# EAGLE design operator-interface-keypad-r1.1 (EAGLE 5.12)
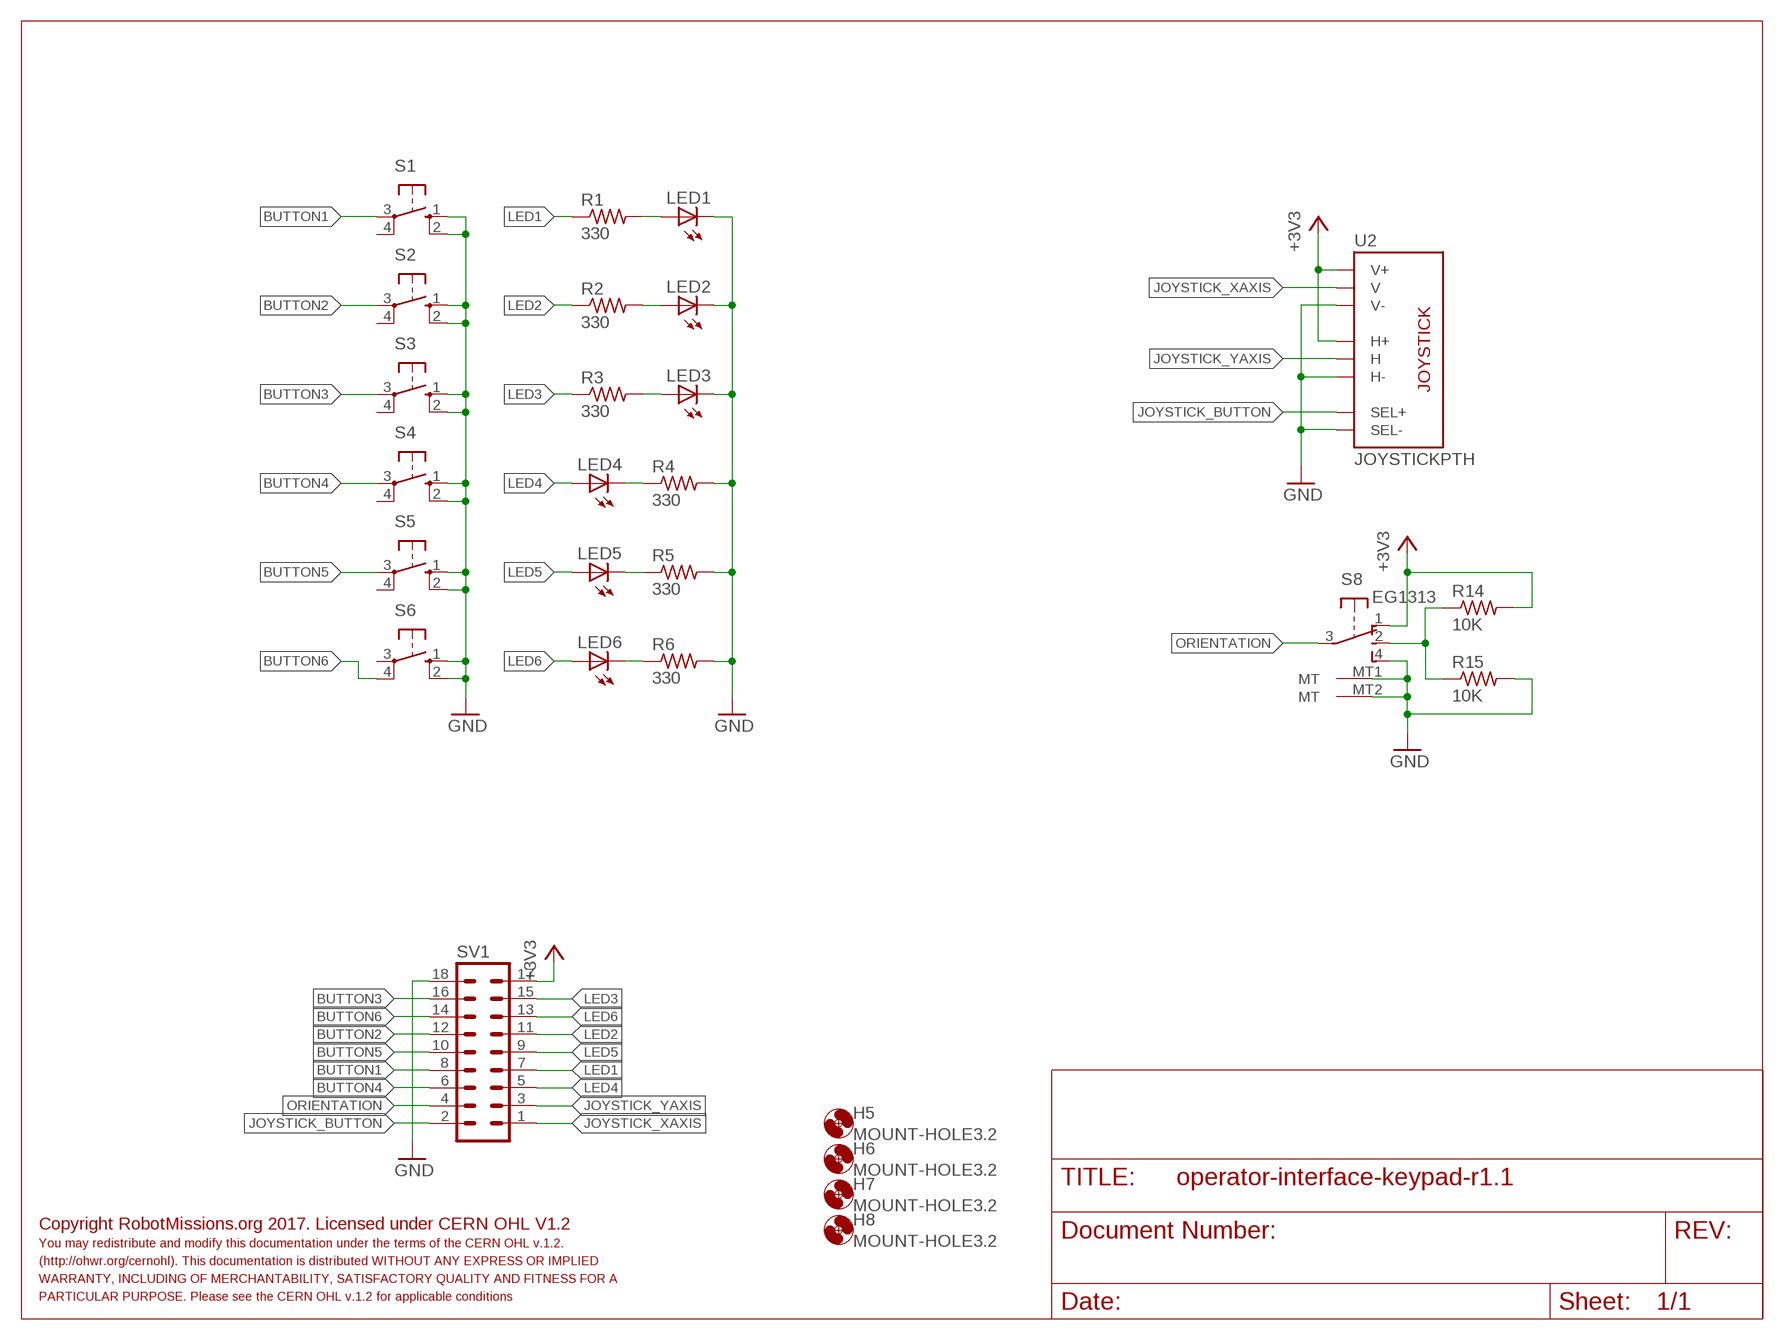
[diagram p0: schematic, sheet 1]

## Parts
H5  MOUNT-HOLE3.2  [3,2]
H6  MOUNT-HOLE3.2  [3,2]
H7  MOUNT-HOLE3.2  [3,2]
H8  MOUNT-HOLE3.2  [3,2]
LED1  LED5MM  [LED5MM]
LED2  LED5MM  [LED5MM]
LED3  LED5MM  [LED5MM]
LED4  LED5MM  [LED5MM]
LED5  LED5MM  [LED5MM]
LED6  LED5MM  [LED5MM]
R1  330  R-US_0207/10  [0207/10]
R2  330  R-US_0207/10  [0207/10]
R3  330  R-US_0207/10  [0207/10]
R4  330  R-US_0207/10  [0207/10]
R5  330  R-US_0207/10  [0207/10]
R6  330  R-US_0207/10  [0207/10]
R14  10K  R-US_0207/10  [0207/10]
R15  10K  R-US_0207/10  [0207/10]
S1  40-XX  [B3F-40XX]
S2  40-XX  [B3F-40XX]
S3  40-XX  [B3F-40XX]
S4  40-XX  [B3F-40XX]
S5  40-XX  [B3F-40XX]
S6  40-XX  [B3F-40XX]
S8  EG1313  [EG1313]
SV1  MA09-2W  [MA09-2W]
U2  JOYSTICKPTH  [JOYSTICK]

## Nets
+3V3: R14.2 S8.1(S1) SV1.17 U2.H1(H+) U2.V1(V+)
BUTTON1: S1.3(P) SV1.8
BUTTON2: S2.3(P) SV1.12
BUTTON3: S3.3(P) SV1.16
BUTTON4: S4.3(P) SV1.6
BUTTON5: S5.3(P) SV1.10
BUTTON6: S6.4(P1) SV1.14
GND: LED1.K(C) LED2.K(C) LED3.K(C) R4.2 R5.2 R6.2 R15.2 S1.1(S) S1.2(S1) S2.1(S) S2.2(S1) S3.1(S) S3.2(S1) S4.1(S) S4.2(S1) S5.1(S) S5.2(S1) S6.1(S) S6.2(S1) S8.4(S3) S8.MT1(MT) S8.MT2(MT) SV1.18 U2.B2A(SEL-) U2.H3(H-) U2.V3(V-)
JOYSTICK_BUTTON: SV1.2 U2.B1A(SEL+)
JOYSTICK_XAXIS: SV1.1 U2.V2(V)
JOYSTICK_YAXIS: SV1.3 U2.H2(H)
LED1: R1.1 SV1.7
LED2: R2.1 SV1.11
LED3: R3.1 SV1.15
LED4: LED4.A SV1.5
LED5: LED5.A SV1.9
LED6: LED6.A SV1.13
N$3: R14.1 R15.1 S8.2(S2)
N$4: LED1.A R1.2
N$5: LED2.A R2.2
N$6: LED3.A R3.2
N$7: LED4.K(C) R4.1
N$8: LED5.K(C) R5.1
N$9: LED6.K(C) R6.1
ORIENTATION: S8.3(COM) SV1.4
Unconnected: S1.4(P1) S2.4(P1) S3.4(P1) S4.4(P1) S5.4(P1) S6.3(P)

## Notes on the sheet
- Copyright RobotMissions.org 2017. Licensed under CERN OHL V1.2
- You may redistribute and modify this documentation under the terms of the CERN OHL v.1.2.
- (http://ohwr.org/cernohl). This documentation is distributed WITHOUT ANY EXPRESS OR IMPLIED
- WARRANTY, INCLUDING OF MERCHANTABILITY, SATISFACTORY QUALITY AND FITNESS FOR A
- PARTICULAR PURPOSE. Please see the CERN OHL v.1.2 for applicable conditions

## Library data of the parts
H5-H8 = holes:MOUNT-HOLE: MOUNTING HOLE with drill center marker
LED1-LED6 = led:LED: LED OSRAM: - CHIPLED LG R971, LG N971, LY N971, LG Q971, LY Q971, LO R971, LY R971 LH N974, LH R974 LS Q976, LO Q976, LY Q976 LO Q996 - Hyper CHIPLED LW Q18S LB Q993, LB Q99A, LB R99A - SideLED LS A670, LO A670, LY A670, LG A670, LP A670 LB A673, LV A673, LT A673, LW A673 LH A674 LY A675 LS A676, LA A676, LO A676, LY A676, LW A676 LS A679, LY A679, LG A679 - Hyper Micro SIDELED® LS Y876, LA Y876, LO Y876, LY Y876 LT Y87S - SmartLED LW L88C, LW L88S LB L89C, LB L89S, LG L890 LS L89K, LO L89K, LY L89K LS L896, LA L896, LO L896, LY L896 - TOPLED LS T670, LO T670, LY T670, LG T670, LP T670 LSG T670, LSP T670, LSY T670, LOP T670, LYG T670 LG T671, LOG T671, LSG T671 LB T673, LV T673, LT T673, LW T673 LH T674 LS T676, LA T676, LO T676, LY T676, LB T676, LH T676, LSB T676, LW T676 LB T67C, LV T67C, LT T67C, LS T67K, LO T67K, LY T67K, LW E67C LS E67B, LA E67B, LO E67B, LY E67B, LB E67C, LV E67C, LT E67C LW T67C LS T679, LY T679, LG T679 LS T770, LO T770, LY T770, LG T770, LP T770 LB T773, LV T773, LT T773, LW T773 LH T774 LS E675, LA E675, LY E675, LS T675 LS T776, LA T776, LO T776, LY T776, LB T776 LHGB T686 LT T68C, LB T68C - Hyper Mini TOPLED® LB M676 - Mini TOPLED Santana® LG M470 LS M47K, LO M47K, LY M47K Source: http://www.osram.convergy.de LUXEON: - LUMILED® LXK2-PW12-R00, LXK2-PW12-S00, LXK2-PW14-U00, LXK2-PW14-V00 LXK2-PM12-R00, LXK2-PM12-S00, LXK2-PM14-U00 LXK2-PE12-Q00, LXK2-PE12-R00, LXK2-PE12-S00, LXK2-PE14-T00, LXK2-PE14-U00 LXK2-PB12-K00, LXK2-PB12-L00, LXK2-PB12-M00, LXK2-PB14-N00, LXK2-PB14-P00, LXK2-PB14-Q00 LXK2-PR12-L00, LXK2-PR12-M00, LXK2-PR14-Q00, LXK2-PR14-R00 LXK2-PD12-Q00, LXK2-PD12-R00, LXK2-PD12-S00 LXK2-PH12-R00, LXK2-PH12-S00 LXK2-PL12-P00, LXK2-PL12-Q00, LXK2-PL12-R00 Source: www.luxeon.com KINGBRIGHT: KA-3528ASYC Source: www.kingbright.com
R1-R6 R14 R15 = rcl:R-US_: RESISTOR, American symbol
S1-S6 = switch-omron:40-XX: OMRON SWITCH; MF: OMRON COMPONENTS USA; MPN: B3F-4000; OC_FARNELL: 176434; OC_NEWARK: 36K3105
S8 = oled:EG1313
SV1 = con-lstb:MA09-2W: PIN HEADER; OC_FARNELL: unknown; OC_NEWARK: unknown
U2 = adafruit:JOYSTICK: Thumb Joystick Joystick commonly found in PS2 controllers. Two pots and a select switch. Adapted from Sparkfun Library (but for more common 6mm switch sticks)

## Board
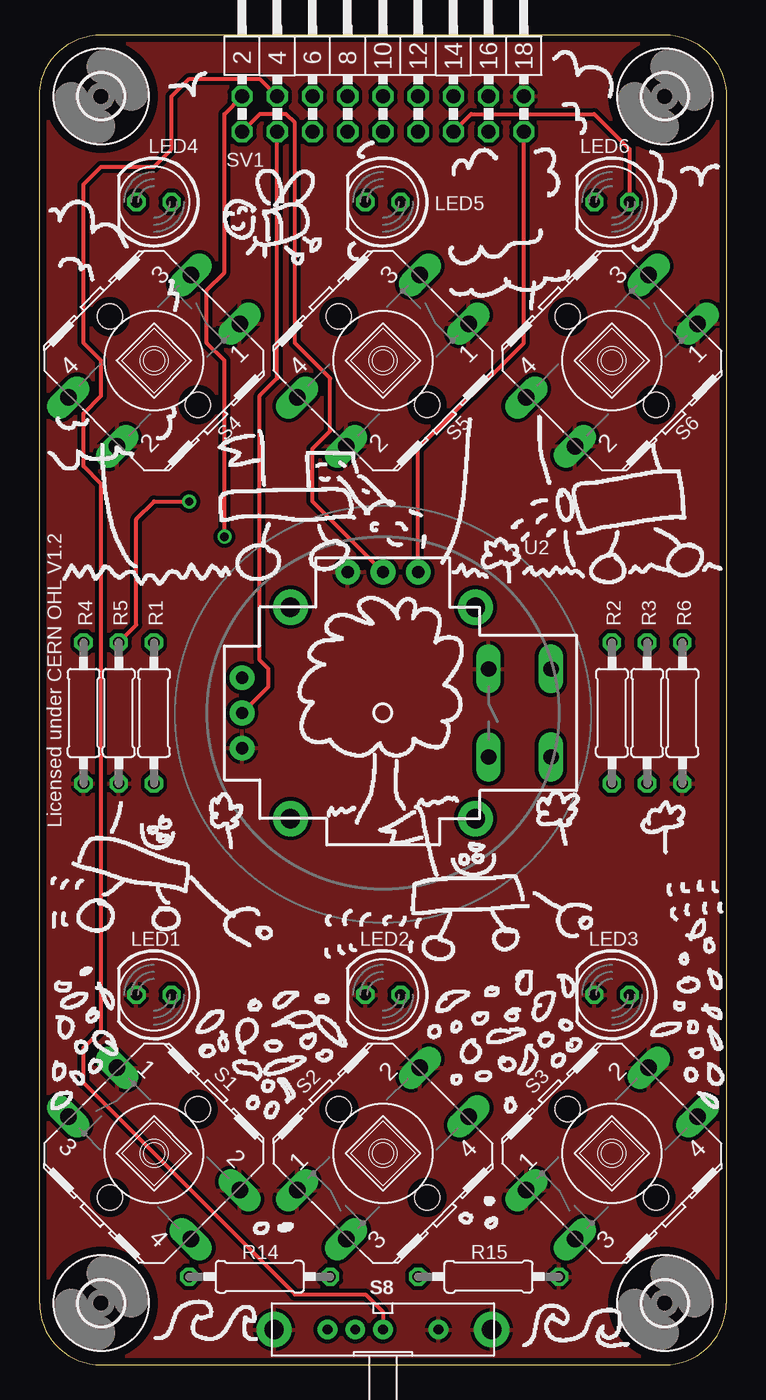
[diagram p1: board, top side]
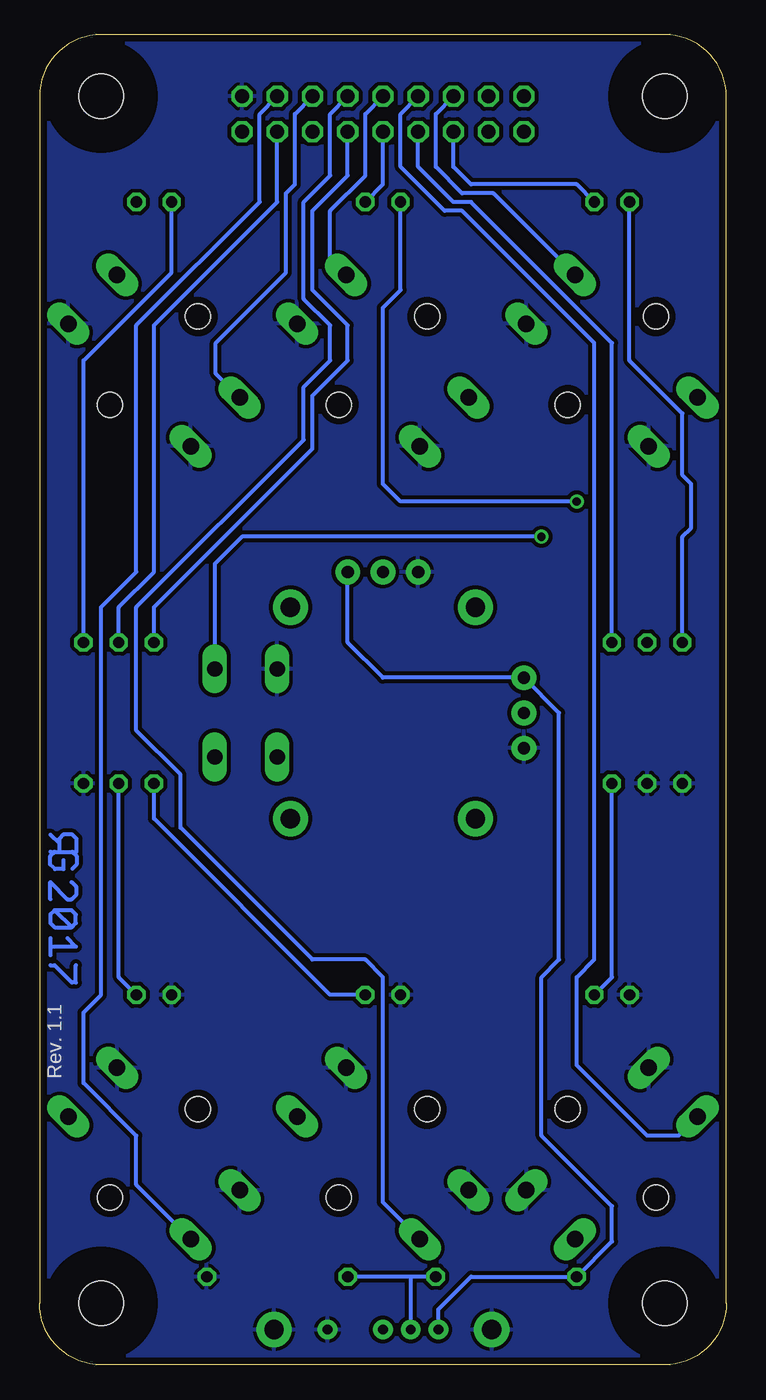
[diagram p2: board, bottom side, seen from below]

Size 49.53 x 95.89 mm. Coordinates in mm from the lower left corner, seen from the top.
Outline: 0,4.45 arc90 4.45,0 45.09,0 arc90 49.53,4.45 49.53,91.44 arc90 45.09,95.89 4.45,95.89 arc90 0,91.44 0,4.45
Copper layers (1*16): Top 0.035mm / dielectric 1.5mm / Bottom 0.035mm
Design rules "default *": minimum track width 10mil, minimum drill 0.5mm, track to track 11mil, track to pad 11mil, pad to pad 11mil, via to via 11mil, smd to smd 11mil, copper to edge 20mil, drill to drill 8mil, minimum pad ring 10mil, minimum via ring 8mil, stop-mask expansion 4mil, vias tented up to drill 25mil, thermal gap 10mil

### Footprints (pad centres in the part's own frame; a part is rotated, then mirrored left to right if it is on the bottom)
3,2 = hole 3.2: 0,0
LED5MM = drill 0.813 octagon: A -1.27,0; K 1.27,0
0207/10 = drill 0.813 octagon: 1 -5.08,0; 2 5.08,0
B3F-40XX = drill 1.194 long: 1 -6.248,2.489; 2 6.248,2.489; 3 -6.248,-2.489; 4 6.248,-2.489 | hole 1.803: 0,-4.496; 0,4.496
EG1313 = drill 0.7 pad 1.422 round: 1 -4,0; 2 -2,0; 3 0,0; 4 4,0 | drill 1.4 pad 2.54 round: MT1 -7.85,0; MT2 7.85,0
MA09-2W = drill 1.016 octagon: 1 -10.16,-1.27; 2 -10.16,1.27; 3 -7.62,-1.27; 4 -7.62,1.27; 5 -5.08,-1.27; 6 -5.08,1.27; 7 -2.54,-1.27; 8 -2.54,1.27; 9 0,-1.27; 10 0,1.27; 11 2.54,-1.27; 12 2.54,1.27; 13 5.08,-1.27; 14 5.08,1.27; 15 7.62,-1.27; 16 7.62,1.27; 17 10.16,-1.27; 18 10.16,1.27
JOYSTICK = drill 1.1 pad 1.778 long: B1A -3.175,12.12; B1B 3.175,12.12; B2A -3.175,7.62; B2B 3.175,7.62 | drill 0.889 pad 1.778 round: H1 -2.54,-10.16; H2 0,-10.16; H3 2.54,-10.16; V1 -10.16,2.54; V2 -10.16,0; V3 -10.16,-2.54 | drill 1.397 pad 2.54 round: MOUNT1 -7.62,6.668; MOUNT2 -7.62,-6.668; MOUNT3 7.62,-6.668; MOUNT4 7.62,6.668

### Placement (x,y rotation side)
H5  4.45,4.45 0 top
H6  45.09,4.45 0 top
H7  4.45,91.44 0 top
H8  45.09,91.44 0 top
LED1  8.25,26.67 180 top
LED2  24.77,26.67 180 top
LED3  41.28,26.67 180 top
LED4  8.25,83.82 180 top
LED5  24.77,83.82 180 top
LED6  41.28,83.82 180 top
R1  8.25,46.99 270 top
R2  41.28,46.99 270 top
R3  43.81,46.99 270 top
R4  3.18,46.99 270 top
R5  5.71,46.99 270 top
R6  46.36,46.99 270 top
R14  15.88,6.35 180 top
R15  32.38,6.35 0 top
S1  8.25,15.24 315 top
S2  24.77,15.24 45 top
S3  41.28,15.24 45 top
S4  8.25,72.39 225 top
S5  24.77,72.39 225 top
S6  41.28,72.39 225 top
S8  24.77,2.54 0 top
SV1  24.77,90.17 0 top
U2  24.77,46.99 270 top
U$1  [TOP-ART-KEYPAD]  0.64,1.27 0 top
U$2  [RGLOGO_SMALL_2017]  48.89,36.83 270 bottom
U$3  [BOTTOM-ART-KEYPAD]  49.53,0 0 bottom
U$4  [OSHW_FILLX150_NOTEXT]  7.3,60.33 0 bottom

### Tracks (layer width: path | path; a pad name or v marks a point on that pad's centre or on a via)
+3V3
  Top 0.305: SV1.17 34.92,73.66 27.3,66.04 U2.V1
  Bottom 0.305: S8.1 20.77,4 18.41,6.35 R14.2 8.25,8.89 8.25,11.43 13.34,16.51 13.34,27.94 12.07,29.21 12.07,46.99 U2.H1 24.77,49.53 27.3,52.07 U2.V1
BUTTON1
  Bottom 0.305: SV1.8 23.5,90.17 23.5,86.36 20.32,83.19 19.05,83.19 9.53,73.66 9.53,29.21 10.79,27.94 10.79,21.59 5.71,16.51 3.46,16.51 S1.3
BUTTON2
  Bottom 0.305: SV1.12 28.57,90.17 28.57,85.72 30.48,83.82 30.48,76.83 28.57,74.93 28.57,72.39 30.48,70.48 30.48,66.67 42.55,54.61 42.55,45.72 39.37,42.55 39.37,38.73 29.84,29.21 26.04,29.21 24.77,27.94 24.77,11.72 S2.3
BUTTON3
  Bottom 0.305: S3.3 42.55,12.99 42.55,16.51 46.36,20.32 46.36,25.4 45.09,26.67 45.09,54.61 42.55,57.15 42.55,74.93 33.66,83.82 33.66,90.17 SV1.16
BUTTON4
  Bottom 0.305: SV1.6 20.96,90.17 20.96,86.36 19.05,84.45 16.8,84.45 S4.3
BUTTON5
  Bottom 0.305: SV1.10 26.04,90.17 26.04,85.72 28.57,83.19 28.57,79.72 S5.3
BUTTON6
  Bottom 0.305: SV1.14 31.12,90.17 31.12,85.09 31.75,84.45 31.75,78.74 36.83,73.66 36.83,71.47 S6.4
GND
  pour Top: 0,95.89 0,0 49.53,0 49.53,95.89
  pour Bottom: 0,95.89 0,0 49.53,0 49.53,95.89
JOYSTICK_BUTTON  (via drill 0.6)
  Top 0.305: SV1.2 13.34,90.17 13.34,78.74 12.07,77.47 12.07,73.66 13.34,72.39 v13.34,59.69
  Bottom 0.305: v13.34,59.69 34.92,59.69 36.88,57.73 U2.B1A
JOYSTICK_XAXIS
  Top 0.305: SV1.1 15.88,90.17 17.78,90.17 18.41,89.53 18.41,73.66 20.96,71.12 20.96,67.31 19.69,66.04 19.69,62.23 U2.V2
JOYSTICK_YAXIS
  Top 0.305: SV1.3 17.14,71.12 15.88,69.85 15.88,50.8 16.51,50.16 16.51,48.9 U2.H2
LED1
  Bottom 0.305: SV1.7 22.23,86.36 19.69,83.82 18.41,83.82 8.25,73.66 R1.1
LED2
  Bottom 0.305: SV1.11 27.3,85.72 29.84,83.19 29.84,77.47 27.3,74.93 27.3,72.39 29.84,69.85 29.84,66.04 41.28,54.61 R2.1
LED3
  Bottom 0.305: SV1.15 32.38,83.82 41.28,74.93 41.28,57.15 43.81,54.61 R3.1
LED4
  Bottom 0.305: SV1.5 19.69,86.36 18.41,85.09 10.79,85.09 LED4.A
LED5
  Bottom 0.305: SV1.9 24.77,85.09 LED5.A
LED6
  Top 0.305: SV1.13 31.12,90.17 40.01,90.17 42.55,87.63 LED6.A
N$3
  Bottom 0.305: S8.2 22.77,6.25 22.86,6.35 | R14.1 22.86,6.35 | 22.86,6.35 R15.1
N$4
  Bottom 0.305: R1.2 8.25,27.94 LED1.A
N$5
  Bottom 0.305: R2.2 41.28,39.37 28.57,26.67 LED2.A
N$6
  Bottom 0.305: R3.2 43.81,27.94 LED3.A
N$7
  Bottom 0.305: LED4.K 6.98,72.39 3.18,68.58 3.18,64.14 2.54,63.5 2.54,60.33 3.18,59.69 R4.1
N$8  (via drill 0.6)
  Top 0.305: R5.1 6.98,53.34 6.98,60.96 8.25,62.23 v10.79,62.23
  Bottom 0.305: v10.79,62.23 23.5,62.23 24.77,63.5 24.77,76.2 23.5,77.47 LED5.K
N$9
  Bottom 0.305: LED6.K 40.01,78.74 46.36,72.39 R6.1
ORIENTATION
  Top 0.305: SV1.4 15.88,92.71 10.79,92.71 9.53,91.44 9.53,87.63 8.25,86.36 4.45,86.36 3.18,85.09 3.18,73.66 4.45,72.39 4.45,69.85 3.18,68.58 3.18,64.77 4.45,63.5 4.45,24.13 3.18,22.86 3.18,20.32 18.41,5.08 23.5,5.08 24.77,3.81 S8.3

### Text on the board
tNames: Licensed under CERN OHL V1.2
bNames: Rev. 1.1